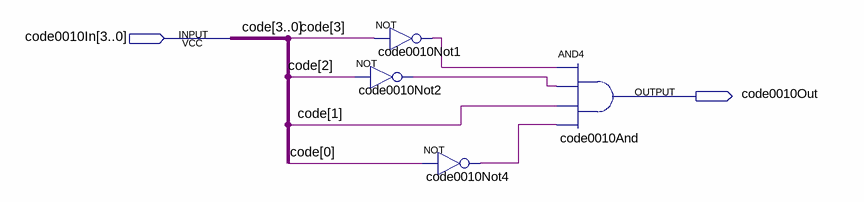
[diagram p0: schematic sheet]
// Quartus schematic code0010.bdf as structural Verilog: 4 symbols, 2 pins
module code0010 (
  input  [3:0] code0010In,
  output code0010Out
);

  wire code0010Not1_out, code0010Not2_out, code0010Not4_out;

  not code0010Not1 (code0010Not1_out, code0010In[3]);
  not code0010Not2 (code0010Not2_out, code0010In[2]);
  not code0010Not4 (code0010Not4_out, code0010In[0]);
  and code0010And (code0010Out, code0010Not1_out, code0010Not2_out, code0010In[1], code0010Not4_out);

  // Other names for the same wires on the sheet: code[3:0] = code0010In
endmodule
